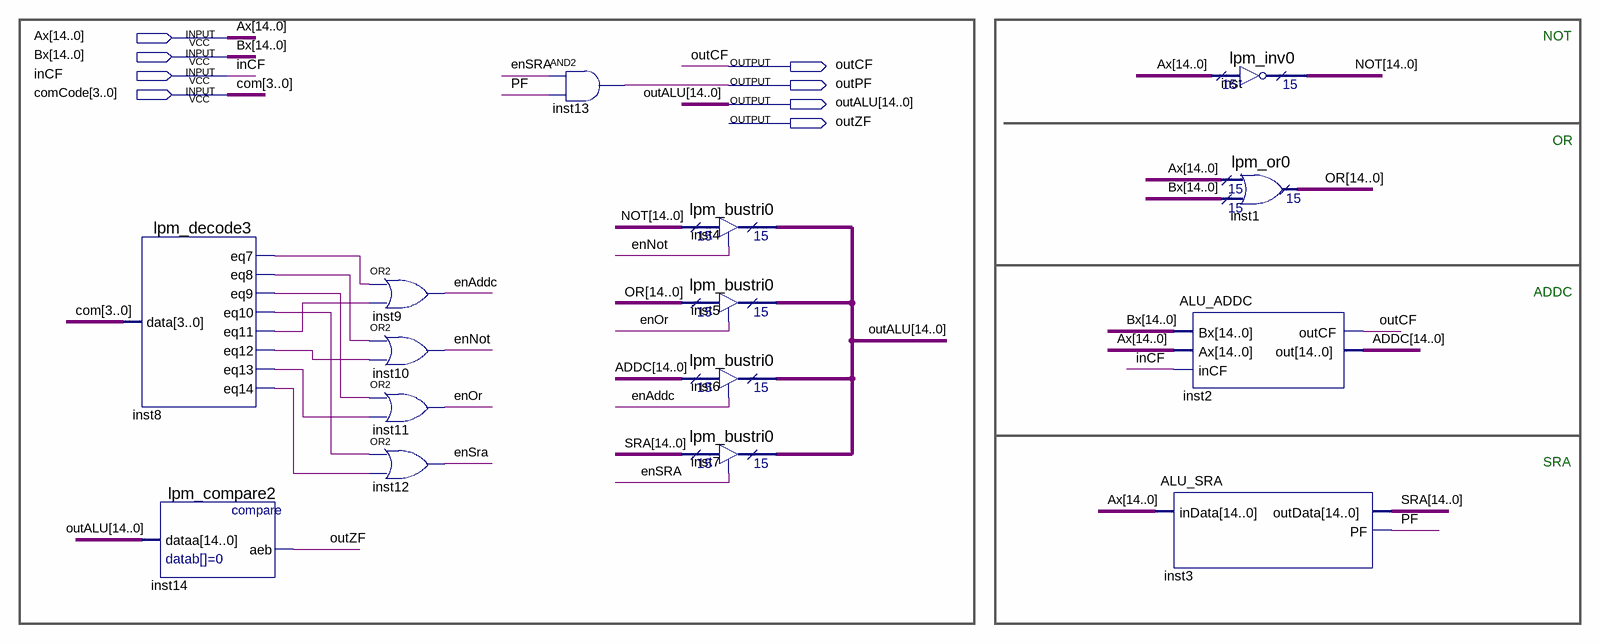
[diagram p0: schematic sheet]
// Quartus schematic ALU.bdf as structural Verilog: 15 symbols, 8 pins
module ALU (
  input  [14:0] Ax,
  input  [14:0] Bx,
  input  inCF,
  input  [3:0] comCode,
  output outCF,
  output outPF,
  output [14:0] outALU,
  output outZF
);

  wire enAddc, enNot, enOr, enSRA, inst8_eq7, inst8_eq8, inst8_eq9, inst8_eq10, inst8_eq11, inst8_eq12,
       inst8_eq13, inst8_eq14, PF;
  wire [14:0] ADDC, NOT, OR, SRA;

  lpm_decode3 inst8 (
    .data(comCode), .eq7(inst8_eq7), .eq8(inst8_eq8), .eq9(inst8_eq9), .eq10(inst8_eq10), .eq11(inst8_eq11),
    .eq12(inst8_eq12), .eq13(inst8_eq13), .eq14(inst8_eq14));
  lpm_compare2 inst14 (.dataa(outALU), .aeb(outZF));
  or inst9 (enAddc, inst8_eq7, inst8_eq11);
  or inst10 (enNot, inst8_eq8, inst8_eq12);
  or inst11 (enOr, inst8_eq9, inst8_eq13);
  or inst12 (enSRA, inst8_eq10, inst8_eq14);
  and inst13 (outPF, enSRA, PF);
  lpm_bustri0 inst4 (.enabledt(enNot), .data(NOT), .tridata(outALU));
  lpm_bustri0 inst5 (.enabledt(enOr), .data(OR), .tridata(outALU));
  lpm_bustri0 inst6 (.enabledt(enAddc), .data(ADDC), .tridata(outALU));
  lpm_bustri0 inst7 (.enabledt(enSRA), .data(SRA), .tridata(outALU));
  ALU_ADDC inst2 (.Bx(Bx), .Ax(Ax), .inCF(inCF), .outCF(outCF), .out(ADDC));
  ALU_SRA inst3 (.inData(Ax), .outData(SRA), .PF(PF));
  lpm_inv0 inst (.data(Ax), .result(NOT));
  lpm_or0 inst1 (.data0x(Ax), .data1x(Bx), .result(OR));

  // Other names for the same wires on the sheet: com[3:0] = comCode

  // Notes on the sheet:
  //   NOT
  //   OR
  //   ADDC
  //   SRA
endmodule
